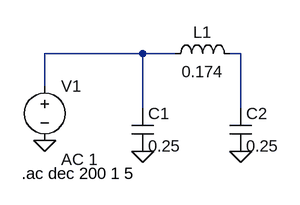
[diagram p0: schematic Draft6.asc]
Draft6.asc, the LTspice schematic file:
Version 4
SHEET 1 880 680
WIRE 112 80 -32 80
WIRE 160 80 112 80
WIRE 256 80 240 80
WIRE -32 128 -32 80
WIRE 112 160 112 80
WIRE 256 160 256 80
FLAG 256 224 0
FLAG 112 224 0
FLAG -32 208 0
SYMBOL cap 96 160 R0
SYMATTR InstName C1
SYMATTR Value 0.25
SYMBOL cap 240 160 R0
SYMATTR InstName C2
SYMATTR Value 0.25
SYMBOL ind 144 96 R270
WINDOW 0 32 56 VTop 2
WINDOW 3 5 56 VBottom 2
SYMATTR InstName L1
SYMATTR Value 0.174
SYMBOL voltage -32 112 R0
WINDOW 123 24 124 Left 2
WINDOW 39 0 0 Left 0
SYMATTR InstName V1
SYMATTR Value ""
SYMATTR Value2 AC 1
TEXT -66 256 Left 2 !.ac dec 200 1 5

The netlist it stands for:
* Draft6.asc
C1 N001 0 0.25
C2 N002 0 0.25
L1 N001 N002 0.174
V1 N001 0 AC 1
.ac dec 200 1 5
.backanno
.end